# Altium schematic sheet BalEv_FPTG_POW_COFIG_v1_0.SchDoc
size A4; CompanyName: HESSO; Address1: Route du Rawyl 47; Address2: 1950 Sion; Address3: Switzerland; DocumentNumber: 5; SheetNumber: 4; SheetTotal: 9; PageSetup: Record=PageOptions|CenterHorizontal=True|CenterVertical=True|PrintScale=1.00|XCorrection=1.00|YCorrection=1.00|PrintKind=1|BorderSize=5000000|LeftOffset=0|BottomOffset=0|Orientation=2|PaperLength=1000|PaperWidth=1000|Scale=100|PaperSource=15|PrintQuality=1200|MediaType=1|DitherType=10|PrintScaleMode=1|PaperKind=A4|PaperIndex=9; ProjectName: Project Name
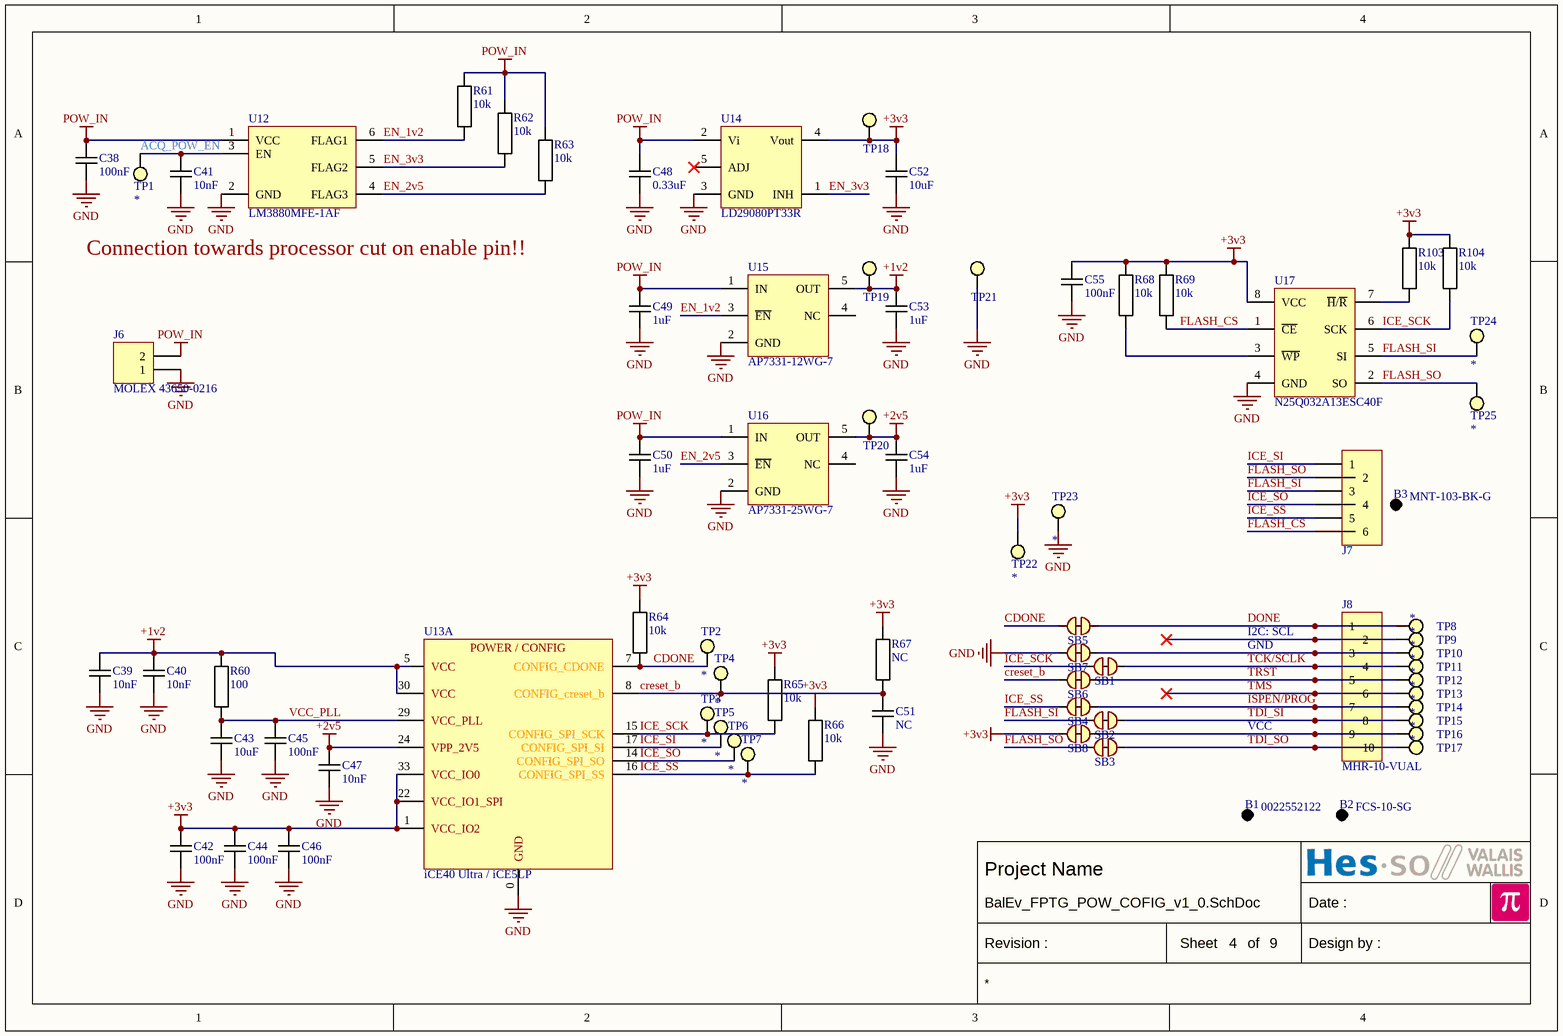
[diagram p0: BalEv_FPTG_POW_COFIG_v1_0.SchDoc]

## Parts
B1  0022552122  (mechanical)
B2  FCS-10-SG  (mechanical)
B3  MNT-103-BK-G  (mechanical)
C38  100nF  [CAPACITOR 1005 REFLOW]
C39  10nF  [CAPACITOR 1005 REFLOW]
C40  10nF  [CAPACITOR 1005 REFLOW]
C41  10nF  [CAPACITOR 1005 REFLOW]
C42  100nF  [CAPACITOR 1005 REFLOW]
C43  10uF  [CAPACITOR 1005 REFLOW]
C44  100nF  [CAPACITOR 1005 REFLOW]
C45  100nF  [CAPACITOR 1005 REFLOW]
C46  100nF  [CAPACITOR 1005 REFLOW]
C47  10nF  [CAPACITOR 1005 REFLOW]
C48  0.33uF  [CAPACITOR 1608 REFLOW]
C49  1uF  [CAPACITOR 1608 REFLOW]
C50  1uF  [CAPACITOR 1608 REFLOW]
C51  NC  [CAPACITOR 1005 REFLOW]
C52  10uF  [CAPACITOR 1608 REFLOW]
C53  1uF  [CAPACITOR 1608 REFLOW]
C54  1uF  [CAPACITOR 1608 REFLOW]
C55  100nF  [CAPACITOR 1005 REFLOW]
J6  MOLEX 43650-0216  [MOLEX 43650-0216]
J7  *  [PinHeader2x3 P2.54]  (value not drawn)
J8  MHR-10-VUAL  [FlatCable2x5 2.54MM Straight TH]
R60  100  [RESISTOR 1005 REFLOW]
R61  10k  [RESISTOR 1005 REFLOW]
R62  10k  [RESISTOR 1005 REFLOW]
R63  10k  [RESISTOR 1005 REFLOW]
R64  10k  [RESISTOR 1005 REFLOW]
R65  10k  [RESISTOR 1005 REFLOW]
R66  10k  [RESISTOR 1005 REFLOW]
R67  NC  [RESISTOR 1005 REFLOW]
R68  10k  [RESISTOR 1005 REFLOW]
R69  10k  [RESISTOR 1005 REFLOW]
R103  10k  [RESISTOR 1005 REFLOW]
R104  10k  [RESISTOR 1005 REFLOW]
SB1  *  [Solder Bridge 1mm Connected]  (value not drawn)  (net tie, no BOM)
SB2  *  [Solder Bridge 1mm Connected]  (value not drawn)  (net tie, no BOM)
SB3  *  [Solder Bridge 1mm Connected]  (value not drawn)  (net tie, no BOM)
SB4  *  [Solder Bridge 1mm Connected]  (value not drawn)  (net tie, no BOM)
SB5  *  [Solder Bridge 1mm Connected]  (value not drawn)  (net tie, no BOM)
SB6  *  [Solder Bridge 1mm Connected]  (value not drawn)  (net tie, no BOM)
SB7  *  [Solder Bridge 1mm Connected]  (value not drawn)  (net tie, no BOM)
SB8  *  [Solder Bridge 1mm Connected]  (value not drawn)  (net tie, no BOM)
TP1  *  [Hole 0.25 D0.8]  (no BOM)
TP2  *  [Hole 0.25 D0.8]  (no BOM)
TP3  *  [Hole 0.25 D0.8]  (no BOM)
TP4  *  [Hole 0.25 D0.8]  (no BOM)
TP5  *  [Hole 0.25 D0.8]  (no BOM)
TP6  *  [Hole 0.25 D0.8]  (no BOM)
TP7  *  [Hole 0.25 D0.8]  (no BOM)
TP8  *  [Hole 0.25 D0.8]  (no BOM)
TP9  *  [Hole 0.25 D0.8]  (no BOM)
TP10  *  [Hole 0.25 D0.8]  (no BOM)
TP11  *  [Hole 0.25 D0.8]  (no BOM)
TP12  *  [Hole 0.25 D0.8]  (no BOM)
TP13  *  [Hole 0.25 D0.8]  (no BOM)
TP14  *  [Hole 0.25 D0.8]  (no BOM)
TP15  *  [Hole 0.25 D0.8]  (no BOM)
TP16  *  [Hole 0.25 D0.8]  (no BOM)
TP17  *  [Hole 0.25 D0.8]  (no BOM)
TP18  *  [Test Point Keystone Miniature RED]  (value not drawn)
TP19  *  [Test Point Keystone Miniature RED]  (value not drawn)
TP20  *  [Test Point Keystone Miniature RED]  (value not drawn)
TP21  *  [Test Point Keystone Miniature BLACK]  (value not drawn)
TP22  *  [Hole 0.25 D0.8]  (no BOM)
TP23  *  [Hole 0.25 D0.8]  (no BOM)
TP24  *  [Hole 0.25 D0.8]  (no BOM)
TP25  *  [Hole 0.25 D0.8]  (no BOM)
U12  LM3880MFE-1AF  [SC70-6 P0.65 C1.4x2.2 H1.0]
U13  iCE40 Ultra / iCE5LP  [QFN50P700X700X100_HS-49N]  (part A of 4)
U14  LD29080PT33R  [TO252-5 P1.27 C6x6.6 H2.4]
U15  AP7331-12WG-7  [SOT23-5 P0.95 C1.6x3.0 H1.3]
U16  AP7331-25WG-7  [SOT23-5 P0.95 C1.6x3.0 H1.3]
U17  N25Q032A13ESC40F  [SO8 P1.27 C4.0X5.0 H1.75]

## Nets
+1v2: C39.2 C40.2 C53.2 R60.2 TP19.1 U13.5(VCC) U13.30(VCC) U15.5(OUT)
+2v5: C47.2 C54.2 TP20.1 U13.24(VPP_2V5) U16.5(OUT)
+3v3: C42.2 C44.2 C46.2 C52.2 C55.2 R64.2 R65.2 R66.2 R67.2 R68.2 R69.2 R103.2 R104.2 SB8.2 TP18.1 TP22.1 U13.1(VCC_IO2) U13.22(VCC_IO1_SPI) U13.33(VCC_IO0) U14.4(Vout) U17.8(VCC)
GND: C38.1 C39.1 C40.1 C41.1 C42.1 C43.1 C44.1 C45.1 C46.1 C47.1 C48.1 C49.1 C50.1 C51.1 C52.1 C53.1 C54.1 C55.1 J6.1 SB7.2 TP21.1 TP23.1 U12.2(GND) U13.0(GND) U14.3(GND) U15.2(GND) U16.2(GND) U17.4(GND)
POW_IN: C38.2 C48.2 C49.2 C50.2 J6.2 R61.2 R62.2 R63.2 U12.1(VCC) U14.2(Vi) U15.1(IN) U16.1(IN)
ACQ_POW_EN: C41.2 TP1.1 U12.3(EN)
CDONE: R64.1 SB5.2 TP2.1 U13.7(CONFIG_CDONE)
creset_b: C51.2 R67.1 SB6.2 TP4.1 U13.8(CONFIG_creset_b)
DONE: J8.1 SB5.1 TP8.1
EN_1v2: R61.1 U12.6(FLAG1) U15.3(~{EN})
EN_2v5: R63.1 U12.4(FLAG3) U16.3(~{EN})
EN_3v3: R62.1 U12.5(FLAG2) U14.1(INH)
FLASH_CS: J7.6 R69.1 U17.1(~{CE})
FLASH_SI: J7.3 SB2.2 TP24.1 U17.5(SI)
FLASH_SO: J7.2 SB3.2 TP25.1 U17.2(SO)
ICE_SCK: R65.1 R104.1 SB1.2 TP3.1 U13.15(CONFIG_SPI_SCK) U17.6(SCK)
ICE_SI: J7.1 TP5.1 U13.17(CONFIG_SPI_SI)
ICE_SO: J7.4 TP6.1 U13.14(CONFIG_SPI_SO)
ICE_SS: J7.5 R66.1 SB4.2 TP7.1 U13.16(CONFIG_SPI_SS)
ISPEN/PROG: J8.7 SB4.1 TP14.1
TCK/SCLK: J8.4 SB1.1 TP11.1
TDI_SI: J8.8 SB2.1 TP15.1
TDI_SO: J8.10 SB3.1 TP17.1
TMS: J8.6 TP13.1
TRST: J8.5 SB6.1 TP12.1
VCC_PLL: C43.2 C45.2 R60.1 U13.29(VCC_PLL)
NetJ8_2: J8.2 TP9.1
NetJ8_3: J8.3 SB7.1 TP10.1
NetJ8_9: J8.9 SB8.1 TP16.1
NetR68_1: R68.1 U17.3(~{WP})
NetR103_1: R103.1 U17.7(~{H}/~{R})

Not connected (* = marked no-connect by the designer): U14 5(ADJ)*; U15 4(NC); U16 4(NC)

## Notes on the sheet
- Connection towards processor cut on enable pin!!
- GND
- (near J8) I2C: SCL
- VCC
- Date :
- Revision :
- Sheet
- of
- Design by :
- (in symbol ICE5LP1K-SG48, part A) POWER / CONFIG

## Library data of the parts
B1-B3 = Bom Entry: Entry for Bom, no PCB symbol
  B1: Value: 0022552122
  B2: Value: FCS-10-SG
  B3: Value: MNT-103-BK-G
C38-C55 = Capacitor
  C38 C42 C44-C46 C55: Value: 100nF
  C39-C41 C47: Value: 10nF
  C43 C52: Value: 10uF
  C48: Value: 0.33uF
  C49 C50 C53 C54: Value: 1uF
  C51: Value: NC
J6 = MOLEX 43650-0216: Micro-Fit 3.0 Vertical Header, 3.00mm Pitch, Single Row, 2 Circuits
J7 = PinHeader2x3: Plug connector; Value: *
J8 = FlatCable2x5: FlatCable2x5 (BHR-10-VUA)
R60-R69 R103 R104 = Resistor
  R60: Value: 100
  R61-R66 R68 R69 R103 R104: Value: 10k
  R67: Value: NC
SB1-SB8 = Solderbridge Connected: Value: *
TP1-TP17 TP22-TP25 = Hole: Value: *
TP18-TP21 = Test Point: Value: *
U12 = LM3880MF-1__: Three-Rail Simple Power Supply Sequencer; Value: LM3880MFE-1AF
U13 = ICE5LP1K-SG48
U14 = LD29080: 800 mA fixed and adjustable output very low drop voltage regulator; Value: LD29080PT33R
U15 U16 = REGPOS SOT23-5 IN,GND,EN,NC,OUT: Generic Positive Voltage Regulator
  U15: Value: AP7331-12WG-7
  U16: Value: AP7331-25WG-7
U17 = IS25LP064D-JB: 32Mb Serial Flash Memory; Value: N25Q032A13ESC40F